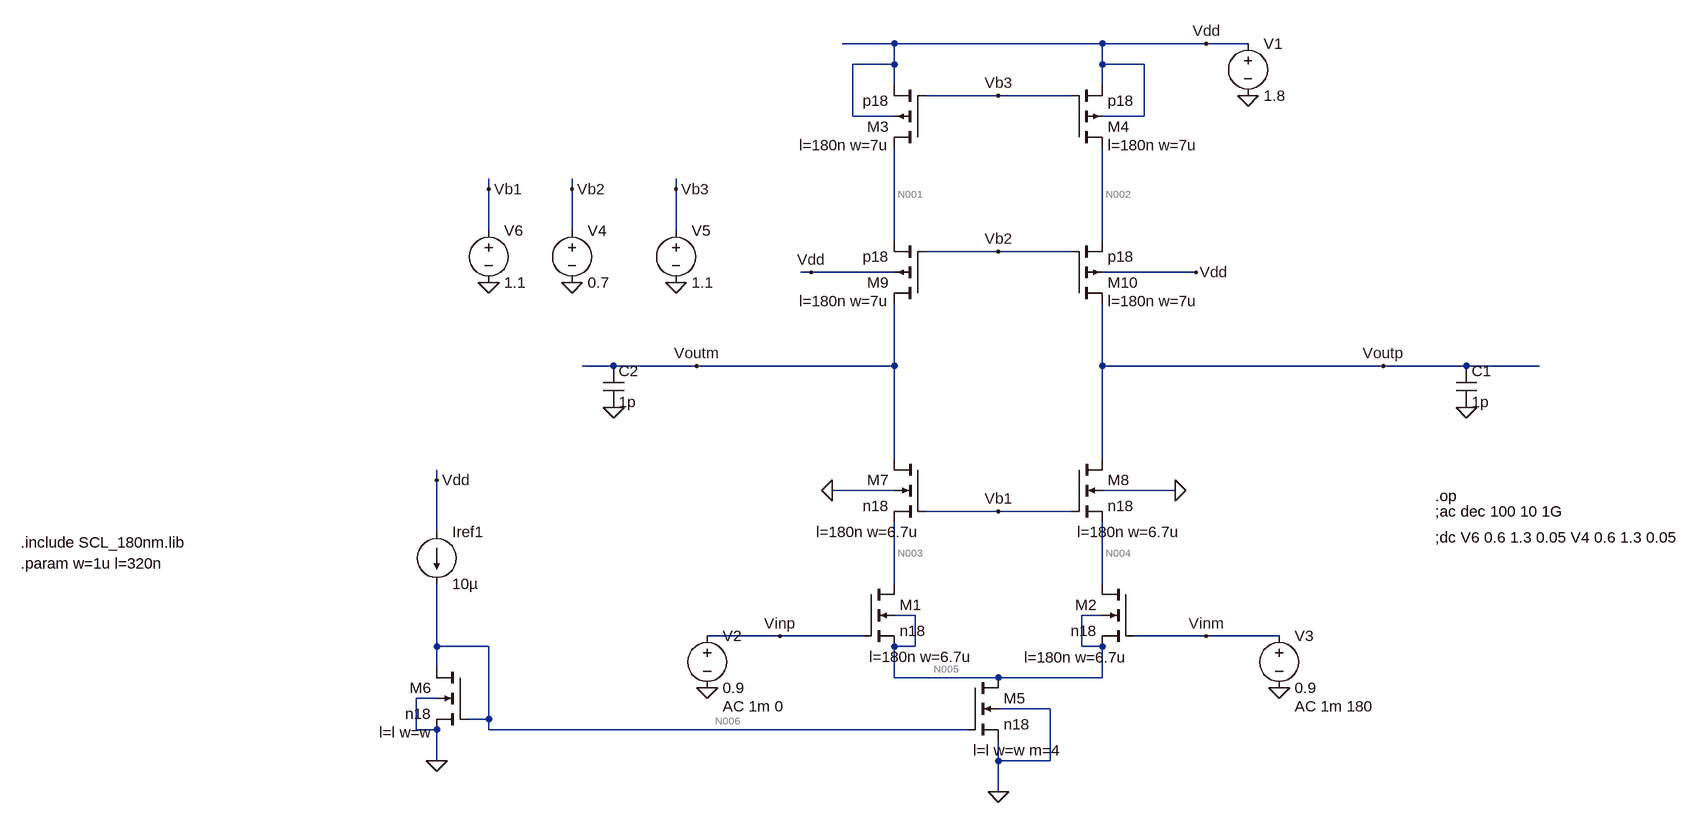
[diagram p0: schematic Telescopic_cascode.asc]
Telescopic_cascode.asc, the LTspice schematic file:
Version 4
SHEET 1 2192 932
WIRE 960 -240 880 -240
WIRE 1280 -240 960 -240
WIRE 1440 -240 1280 -240
WIRE 1504 -240 1440 -240
WIRE 960 -208 960 -240
WIRE 960 -208 896 -208
WIRE 1280 -208 1280 -240
WIRE 1344 -208 1280 -208
WIRE 960 -176 960 -208
WIRE 1280 -176 1280 -208
WIRE 1120 -160 1008 -160
WIRE 1232 -160 1120 -160
WIRE 896 -128 896 -208
WIRE 960 -128 896 -128
WIRE 1344 -128 1344 -208
WIRE 1344 -128 1280 -128
WIRE 336 -16 336 -32
WIRE 464 -16 464 -32
WIRE 624 -16 624 -32
WIRE 336 48 336 -16
WIRE 464 48 464 -16
WIRE 624 48 624 -16
WIRE 960 64 960 -80
WIRE 1280 64 1280 -80
WIRE 1120 80 1008 80
WIRE 1232 80 1120 80
WIRE 832 112 816 112
WIRE 960 112 832 112
WIRE 1424 112 1280 112
WIRE 528 256 480 256
WIRE 656 256 528 256
WIRE 960 256 960 160
WIRE 960 256 656 256
WIRE 1280 256 1280 160
WIRE 1712 256 1280 256
WIRE 1840 256 1712 256
WIRE 1952 256 1840 256
WIRE 960 400 960 256
WIRE 1280 400 1280 256
WIRE 256 432 256 416
WIRE 960 448 864 448
WIRE 1392 448 1280 448
WIRE 1120 480 1008 480
WIRE 1232 480 1120 480
WIRE 256 512 256 432
WIRE 960 592 960 496
WIRE 1280 592 1280 496
WIRE 992 640 960 640
WIRE 1280 640 1248 640
WIRE 784 672 672 672
WIRE 912 672 784 672
WIRE 1440 672 1328 672
WIRE 1552 672 1440 672
WIRE 256 688 256 592
WIRE 336 688 256 688
WIRE 992 688 992 640
WIRE 992 688 960 688
WIRE 1248 688 1248 640
WIRE 1280 688 1248 688
WIRE 256 720 256 688
WIRE 960 736 960 688
WIRE 1120 736 960 736
WIRE 1280 736 1280 688
WIRE 1280 736 1120 736
WIRE 256 768 224 768
WIRE 1200 784 1120 784
WIRE 336 800 336 688
WIRE 336 800 304 800
WIRE 224 816 224 768
WIRE 256 816 224 816
WIRE 336 816 336 800
WIRE 1072 816 336 816
WIRE 256 864 256 816
WIRE 1120 864 1120 832
WIRE 1200 864 1200 784
WIRE 1200 864 1120 864
WIRE 1120 912 1120 864
FLAG 1504 -160 0
FLAG 1552 752 0
FLAG 672 752 0
FLAG 1440 -240 Vdd
FLAG 784 672 Vinp
FLAG 1440 672 Vinm
FLAG 1712 256 Voutp
FLAG 656 256 Voutm
FLAG 1840 320 0
FLAG 528 320 0
FLAG 1120 912 0
FLAG 1120 -160 Vb3
FLAG 464 128 0
FLAG 624 128 0
FLAG 624 -16 Vb3
FLAG 256 864 0
FLAG 256 432 Vdd
FLAG 1120 80 Vb2
FLAG 1120 480 Vb1
FLAG 464 -16 Vb2
FLAG 336 128 0
FLAG 336 -16 Vb1
FLAG 1392 448 0
FLAG 864 448 0
FLAG 832 112 Vdd
FLAG 1424 112 Vdd
DATAFLAG 992 -240 ""
DATAFLAG 1040 -160 ""
DATAFLAG 960 0 ""
DATAFLAG 960 224 ""
DATAFLAG 960 560 ""
DATAFLAG 1040 736 ""
SYMBOL nmos4 912 592 R0
WINDOW 123 9 112 Left 2
SYMATTR Value2 l=180n w=6.7u
SYMATTR InstName M1
SYMATTR Value n18
SYMBOL nmos4 1328 592 M0
WINDOW 123 9 113 Left 2
SYMATTR Value2 l=180n w=6.7u
SYMATTR InstName M2
SYMATTR Value n18
SYMBOL voltage 1504 -256 R0
WINDOW 123 0 0 Left 0
WINDOW 39 0 0 Left 0
SYMATTR InstName V1
SYMATTR Value 1.8
SYMBOL voltage 672 656 R0
WINDOW 123 24 124 Left 2
WINDOW 39 0 0 Left 0
SYMATTR Value2 AC 1m 0
SYMATTR InstName V2
SYMATTR Value 0.9
SYMBOL voltage 1552 656 R0
WINDOW 123 24 124 Left 2
WINDOW 39 0 0 Left 0
SYMATTR Value2 AC 1m 180
SYMATTR InstName V3
SYMATTR Value 0.9
SYMBOL cap 1824 256 R0
SYMATTR InstName C1
SYMATTR Value 1p
SYMBOL cap 512 256 R0
SYMATTR InstName C2
SYMATTR Value 1p
SYMBOL pmos4 1008 -80 R180
WINDOW 123 56 4 Left 2
SYMATTR Value2 l=180n w=7u
SYMATTR InstName M3
SYMATTR Value p18
SYMBOL pmos4 1232 -80 M180
WINDOW 123 56 4 Left 2
SYMATTR Value2 l=180n w=7u
SYMATTR InstName M4
SYMATTR Value p18
SYMBOL nmos4 1072 736 R0
WINDOW 123 9 112 Left 2
SYMATTR Value2 l=l w=w m=4
SYMATTR InstName M5
SYMATTR Value n18
SYMBOL voltage 464 32 R0
WINDOW 123 0 0 Left 0
WINDOW 39 0 0 Left 0
SYMATTR InstName V4
SYMATTR Value 0.7
SYMBOL voltage 624 32 R0
WINDOW 123 0 0 Left 0
WINDOW 39 0 0 Left 0
SYMATTR InstName V5
SYMATTR Value 1.1
SYMBOL nmos4 304 720 M0
WINDOW 123 56 100 Left 2
SYMATTR Value2 l=l w=w
SYMATTR InstName M6
SYMATTR Value n18
SYMBOL current 256 512 R0
WINDOW 123 0 0 Left 0
WINDOW 39 0 0 Left 0
SYMATTR InstName Iref1
SYMATTR Value 10µ
SYMBOL pmos4 1008 160 R180
WINDOW 123 56 4 Left 2
SYMATTR Value2 l=180n w=7u
SYMATTR InstName M9
SYMATTR Value p18
SYMBOL pmos4 1232 160 M180
WINDOW 123 56 4 Left 2
SYMATTR Value2 l=180n w=7u
SYMATTR InstName M10
SYMATTR Value p18
SYMBOL voltage 336 32 R0
WINDOW 123 0 0 Left 0
WINDOW 39 0 0 Left 0
SYMATTR InstName V6
SYMATTR Value 1.1
SYMBOL nmos4 1008 400 M0
WINDOW 123 9 112 Left 2
SYMATTR Value2 l=180n w=6.7u
SYMATTR InstName M7
SYMATTR Value n18
SYMBOL nmos4 1232 400 R0
WINDOW 123 9 112 Left 2
SYMATTR Value2 l=180n w=6.7u
SYMATTR InstName M8
SYMATTR Value n18
TEXT -384 528 Left 2 !.include SCL_180nm.lib
TEXT 1792 480 Left 2 !;ac dec 100 10 1G
TEXT 1792 456 Left 2 !.op
TEXT -384 560 Left 2 !.param w=1u l=320n
TEXT 1792 520 Left 2 !;dc V6 0.6 1.3 0.05 V4 0.6 1.3 0.05

The netlist it stands for:
* Telescopic_cascode.asc
M1 N003 Vinp N005 N005 n18 l=180n w=6.7u
M2 N004 Vinm N005 N005 n18 l=180n w=6.7u
V1 Vdd 0 1.8
V2 Vinp 0 0.9 AC 1m 0
V3 Vinm 0 0.9 AC 1m 180
C1 Voutp 0 1p
C2 Voutm 0 1p
M3 N001 Vb3 Vdd Vdd p18 l=180n w=7u
M4 N002 Vb3 Vdd Vdd p18 l=180n w=7u
M5 N005 N006 0 0 n18 l=l w=w m=4
V4 Vb2 0 0.7
V5 Vb3 0 1.1
M6 N006 N006 0 0 n18 l=l w=w
Iref1 Vdd N006 10µ
M9 Voutm Vb2 N001 Vdd p18 l=180n w=7u
M10 Voutp Vb2 N002 Vdd p18 l=180n w=7u
V6 Vb1 0 1.1
M7 Voutm Vb1 N003 0 n18 l=180n w=6.7u
M8 Voutp Vb1 N004 0 n18 l=180n w=6.7u
.model NMOS NMOS
.model PMOS PMOS
.lib standard.mos
.include SCL_180nm.lib
;ac dec 100 10 1G
.op
.param w=1u l=320n
;dc V6 0.6 1.3 0.05 V4 0.6 1.3 0.05
.backanno
.end

* Results of the author's LTspice run, read from the files saved beside the schematic
* Operating Point:
*   V(n003) = 157.4 mV
*   V(vinp) = 900 mV
*   V(n005) = 146 mV
*   V(n004) = 157.4 mV
*   V(vinm) = 900 mV
*   V(vdd) = 1.8 V
*   V(voutp) = 163.7 mV
*   V(voutm) = 163.7 mV
*   V(n001) = 1.482 V
*   V(vb3) = 1.1 V
*   V(n002) = 1.482 V
*   V(n006) = 630.1 mV
*   V(vb2) = 700 mV
*   V(vb1) = 1.1 V
*   Id(M10) = -16.49 µA
*   Ig(M10) = 0 A
*   Ib(M10) = 1.974 pA
*   Is(M10) = 16.49 µA
*   Id(M9) = -16.49 µA
*   Ig(M9) = 0 A
*   Ib(M9) = 1.974 pA
*   Is(M9) = 16.49 µA
*   Id(M4) = -16.49 µA
*   Ig(M4) = 0 A
*   Ib(M4) = 328.2 fA
*   Is(M4) = 16.49 µA
*   Id(M3) = -16.49 µA
*   Ig(M3) = 0 A
*   Ib(M3) = 328.2 fA
*   Is(M3) = 16.49 µA
*   Id(M8) = 16.49 µA
*   Ig(M8) = 0 A
*   Ib(M8) = -340.9 fA
*   Is(M8) = -16.49 µA
*   Id(M7) = 16.49 µA
*   Ig(M7) = 0 A
*   Ib(M7) = -340.9 fA
*   Is(M7) = -16.49 µA
*   Id(M6) = 10 µA
*   Ig(M6) = 0 A
*   Ib(M6) = -640.1 fA
*   Is(M6) = -10 µA
*   Id(M5) = 32.99 µA
*   Ig(M5) = 0 A
*   Ib(M5) = -623.3 fA
*   Is(M5) = -32.99 µA
*   Id(M2) = 16.49 µA
*   Ig(M2) = 0 A
*   Ib(M2) = -14.07 fA
*   Is(M2) = -16.49 µA
*   Id(M1) = 16.49 µA
*   Ig(M1) = 0 A
*   Ib(M1) = -14.07 fA
*   Is(M1) = -16.49 µA
*   I(C2) = 0 A
*   I(C1) = 0 A
*   I(Iref1) = 10 µA
*   I(V6) = 0 A
*   I(V5) = 0 A
*   I(V4) = 0 A
*   I(V3) = 0 A
*   I(V2) = 0 A
*   I(V1) = -42.99 µA